# Altium schematic sheet Communication Interfaces Connectors.SchDoc
size A4
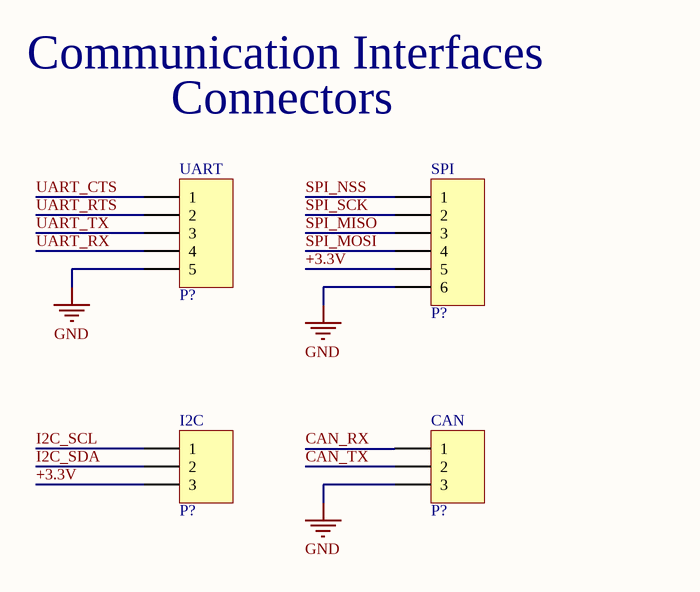
[diagram p0: Communication Interfaces Connectors.SchDoc]

## Parts
(Parts that share a designator on the sheet are numbered #1, #2 ... from top to bottom, then left to right.)
P?#1  HDR1X5  [Molex SPOX Horizontal 5 Circuits]  (value not drawn)
P?#2  HDR1X6  [Molex SPOX Horizontal 6 Circuits]  (value not drawn)
P?#3  HDR1X3  [Molex SPOX Horizontal 3 Circuits]  (value not drawn)
P?#4  HDR1X3  [HDR1X3]  (value not drawn)

## Nets
GND: P?#1.5 P?#2.6 P?#4.3
+3.3V: P?#2.5 P?#3.3
CAN_RX: P?#4.1
CAN_TX: P?#4.2
I2C_SCL: P?#3.1
I2C_SDA: P?#3.2
SPI_MISO: P?#2.3
SPI_MOSI: P?#2.4
SPI_NSS: P?#2.1
SPI_SCK: P?#2.2
UART_CTS: P?#1.1
UART_RTS: P?#1.2
UART_RX: P?#1.4
UART_TX: P?#1.3

## Notes on the sheet
- Communication Interfaces
- Connectors
- (near P?#1) UART
- (near P?#2) SPI
- (near P?#3) I2C
- (near P?#4) CAN

## Library data of the parts
P?#1 = HDR1X5: Header, 5-Pin; LatestRevisionDate: 17-Jul-2002; LatestRevisionNote: Re-released for DXP Platform.; Publisher: Altium Limited
P?#2 = HDR1X6: Header, 6-Pin; LatestRevisionDate: 17-Jul-2002; LatestRevisionNote: Re-released for DXP Platform.; Publisher: Altium Limited
P?#3 P?#4 = HDR1X3: Header, 3-Pin; LatestRevisionDate: 17-Jul-2002; LatestRevisionNote: Re-released for DXP Platform.; Publisher: Altium Limited